# EasyEDA schematic Sheet_1.json
TITLE: 8 Bit ALU - 1 Bit; REV: 1.0; Date: 2021-12-28; Sheet: 1/3; Drawn By: Koehler, Paul; Company: komed3
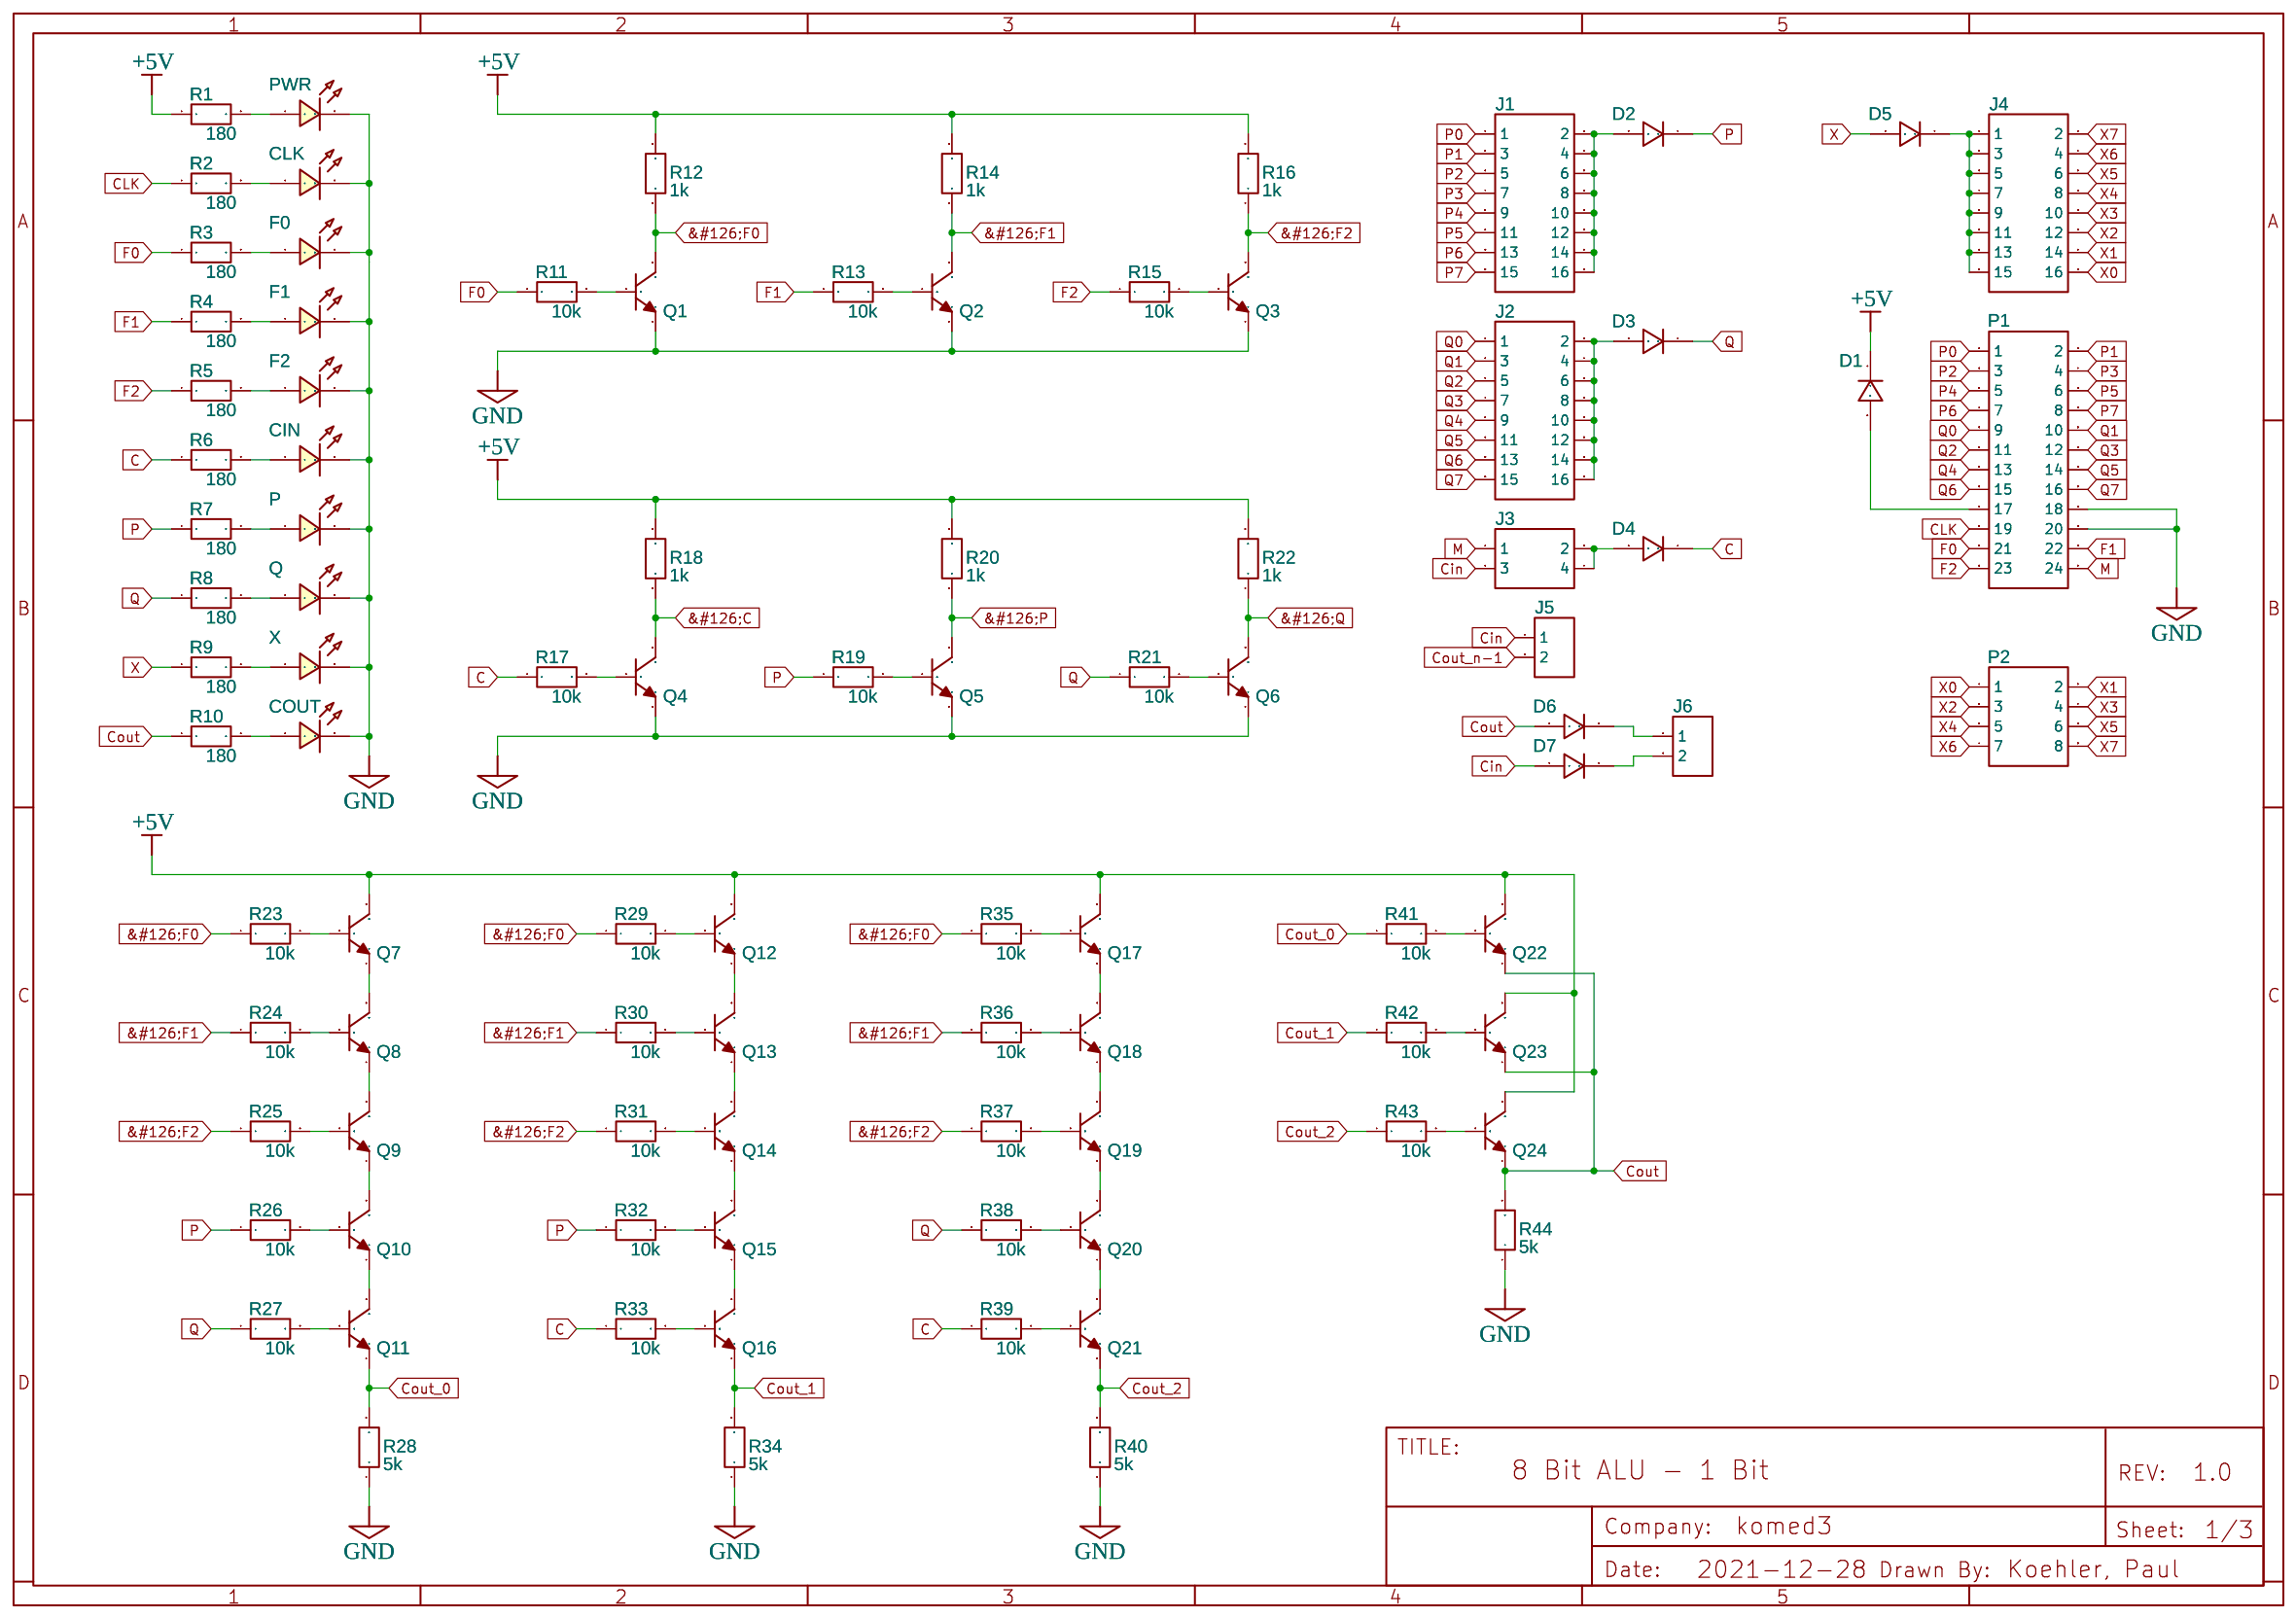
[diagram p0: schematic sheet]

## Parts
CIN  LED-TH-5mm_R  [LED-TH_BD5.0_RED]
CLK  LED-TH-5mm_R  [LED-TH_BD5.0_RED]
COUT  LED-TH-5mm_R  [LED-TH_BD5.0_RED]
D1  1N4007  [DO-41_BD2.4-L4.7-P8.70-D0.9-RD]
D2  1N4007  [DO-41_BD2.4-L4.7-P8.70-D0.9-RD]
D3  1N4007  [DO-41_BD2.4-L4.7-P8.70-D0.9-RD]
D4  1N4007  [DO-41_BD2.4-L4.7-P8.70-D0.9-RD]
D5  1N4007  [DO-41_BD2.4-L4.7-P8.70-D0.9-RD]
D6  1N4007  [DO-41_BD2.4-L4.7-P8.70-D0.9-RD]
D7  1N4007  [DO-41_BD2.4-L4.7-P8.70-D0.9-RD]
F0  LED-TH-5mm_R  [LED-TH_BD5.0_RED]
F1  LED-TH-5mm_R  [LED-TH_BD5.0_RED]
F2  LED-TH-5mm_R  [LED-TH_BD5.0_RED]
J1  HDR-M-2.54_2x8  [HDR-M-2.54_2X8]
J2  HDR-M-2.54_2x8  [HDR-M-2.54_2X8]
J3  HDR-M-2.54_2x2  [HDR-M-2.54_2X2]
J4  HDR-M-2.54_2x8  [HDR-M-2.54_2X8]
J5  HDR-M-2.54_1x2  [HDR-M-2.54_1X2]
J6  HDR-M-2.54_1x2  [HDR-M-2.54_1X2]
P  LED-TH-5mm_R  [LED-TH_BD5.0_RED]
P1  HDR-IDC-2.54-2X12P  [IDC-TH_24P-P2.54-V-R2-C12-S2.54]
P2  HDR-IDC-2.54-2X4P  [IDC-TH_8P-P2.54-V-R2-C4-S2.54]
PWR  LED-TH-5mm_R  [LED-TH_BD5.0_RED]
Q  LED-TH-5mm_R  [LED-TH_BD5.0_RED]
Q1  2N3904(TO-92)  [TO-92-3_L5.1-W4.1-P1.27-L]
Q2  2N3904(TO-92)  [TO-92-3_L5.1-W4.1-P1.27-L]
Q3  2N3904(TO-92)  [TO-92-3_L5.1-W4.1-P1.27-L]
Q4  2N3904(TO-92)  [TO-92-3_L5.1-W4.1-P1.27-L]
Q5  2N3904(TO-92)  [TO-92-3_L5.1-W4.1-P1.27-L]
Q6  2N3904(TO-92)  [TO-92-3_L5.1-W4.1-P1.27-L]
Q7  2N3904(TO-92)  [TO-92-3_L5.1-W4.1-P1.27-L]
Q8  2N3904(TO-92)  [TO-92-3_L5.1-W4.1-P1.27-L]
Q9  2N3904(TO-92)  [TO-92-3_L5.1-W4.1-P1.27-L]
Q10  2N3904(TO-92)  [TO-92-3_L5.1-W4.1-P1.27-L]
Q11  2N3904(TO-92)  [TO-92-3_L5.1-W4.1-P1.27-L]
Q12  2N3904(TO-92)  [TO-92-3_L5.1-W4.1-P1.27-L]
Q13  2N3904(TO-92)  [TO-92-3_L5.1-W4.1-P1.27-L]
Q14  2N3904(TO-92)  [TO-92-3_L5.1-W4.1-P1.27-L]
Q15  2N3904(TO-92)  [TO-92-3_L5.1-W4.1-P1.27-L]
Q16  2N3904(TO-92)  [TO-92-3_L5.1-W4.1-P1.27-L]
Q17  2N3904(TO-92)  [TO-92-3_L5.1-W4.1-P1.27-L]
Q18  2N3904(TO-92)  [TO-92-3_L5.1-W4.1-P1.27-L]
Q19  2N3904(TO-92)  [TO-92-3_L5.1-W4.1-P1.27-L]
Q20  2N3904(TO-92)  [TO-92-3_L5.1-W4.1-P1.27-L]
Q21  2N3904(TO-92)  [TO-92-3_L5.1-W4.1-P1.27-L]
Q22  2N3904(TO-92)  [TO-92-3_L5.1-W4.1-P1.27-L]
Q23  2N3904(TO-92)  [TO-92-3_L5.1-W4.1-P1.27-L]
Q24  2N3904(TO-92)  [TO-92-3_L5.1-W4.1-P1.27-L]
R1  180  [RESISTOR-1/2W-VERTICAL]
R2  180  [RESISTOR-1/2W-VERTICAL]
R3  180  [RESISTOR-1/2W-VERTICAL]
R4  180  [RESISTOR-1/2W-VERTICAL]
R5  180  [RESISTOR-1/2W-VERTICAL]
R6  180  [RESISTOR-1/2W-VERTICAL]
R7  180  [RESISTOR-1/2W-VERTICAL]
R8  180  [RESISTOR-1/2W-VERTICAL]
R9  180  [RESISTOR-1/2W-VERTICAL]
R10  180  [RESISTOR-1/2W-VERTICAL]
R11  10k  [RESISTOR-1/2W-VERTICAL]
R12  1k  [RESISTOR-1/2W-VERTICAL]
R13  10k  [RESISTOR-1/2W-VERTICAL]
R14  1k  [RESISTOR-1/2W-VERTICAL]
R15  10k  [RESISTOR-1/2W-VERTICAL]
R16  1k  [RESISTOR-1/2W-VERTICAL]
R17  10k  [RESISTOR-1/2W-VERTICAL]
R18  1k  [RESISTOR-1/2W-VERTICAL]
R19  10k  [RESISTOR-1/2W-VERTICAL]
R20  1k  [RESISTOR-1/2W-VERTICAL]
R21  10k  [RESISTOR-1/2W-VERTICAL]
R22  1k  [RESISTOR-1/2W-VERTICAL]
R23  10k  [RESISTOR-1/2W-VERTICAL]
R24  10k  [RESISTOR-1/2W-VERTICAL]
R25  10k  [RESISTOR-1/2W-VERTICAL]
R26  10k  [RESISTOR-1/2W-VERTICAL]
R27  10k  [RESISTOR-1/2W-VERTICAL]
R28  5k  [RESISTOR-1/2W-VERTICAL]
R29  10k  [RESISTOR-1/2W-VERTICAL]
R30  10k  [RESISTOR-1/2W-VERTICAL]
R31  10k  [RESISTOR-1/2W-VERTICAL]
R32  10k  [RESISTOR-1/2W-VERTICAL]
R33  10k  [RESISTOR-1/2W-VERTICAL]
R34  5k  [RESISTOR-1/2W-VERTICAL]
R35  10k  [RESISTOR-1/2W-VERTICAL]
R36  10k  [RESISTOR-1/2W-VERTICAL]
R37  10k  [RESISTOR-1/2W-VERTICAL]
R38  10k  [RESISTOR-1/2W-VERTICAL]
R39  10k  [RESISTOR-1/2W-VERTICAL]
R40  5k  [RESISTOR-1/2W-VERTICAL]
R41  10k  [RESISTOR-1/2W-VERTICAL]
R42  10k  [RESISTOR-1/2W-VERTICAL]
R43  10k  [RESISTOR-1/2W-VERTICAL]
R44  5k  [RESISTOR-1/2W-VERTICAL]
X  LED-TH-5mm_R  [LED-TH_BD5.0_RED]

## Library data of the parts
CIN CLK COUT F0-F2 P PWR Q X = LED-TH-5mm_R: Manufacturer: EVERLIGHT(台湾亿光); Manufacturer Part: 333-2SURD/S530-A3; Supplier Part: C87271; Supplier: LCSC; Contributor: LCEDA_Lib
D1-D7 = 1N4007: Supplier: LCSC; Manufacturer: SEMTECH; Supplier Part: C106903; Contributor: LCEDA_Lib
J1 J2 J4 = HDR-M-2.54_2x8: Supplier Part: C68234; Supplier: LCSC; Contributor: LCEDA_Lib
J3 = HDR-M-2.54_2x2: Supplier Part: C66690; Supplier: LCSC; Contributor: LCEDA_Lib
J5 J6 = HDR-M-2.54_1x2: Supplier Part: C124375; Supplier: LCSC; Contributor: LCEDA_Lib
P1 = HDR-IDC-2.54-2X12P: Supplier: LCSC; Manufacturer: BOOMELE; Manufacturer Part: IDC Box 2X12 2.54MM; image: //image.lceda.cn/szlcsc/C9137.jpg; Supplier Part: C9137
P2 = HDR-IDC-2.54-2X4P: Supplier: LCSC; Manufacturer: BOOMELE; Manufacturer Part: IDC Box 2X4 2.54MM; image: //image.lceda.cn/szlcsc/C9135.jpg; Supplier Part: C9135
Q1-Q24 = 2N3904(TO-92): Supplier: LCSC; Manufacturer: SEMTECH; Manufacturer Part: 2N3904; Supplier Part: C118538; Contributor: LCEDA_Lib
R1-R44 = R_AXIAL-0.3_EU: Contributor: LCEDA_Lib

## Nets
+5V: D1.1 Q7.3(C) Q12.3(C) Q17.3(C) Q22.3(C) Q23.3(C) Q24.3(C) R1.1 R12.2 R14.2 R16.2 R18.2 R20.2 R22.2
GND: CIN.2 CLK.2 COUT.2 F0.2 F1.2 F2.2 P.2 P1.18 P1.20 PWR.2 Q.2 Q1.1(E) Q2.1(E) Q3.1(E) Q4.1(E) Q5.1(E) Q6.1(E) R28.1 R34.1 R40.1 R44.1 X.2
&#126;C: Q4.3(C) R18.1
&#126;F0: Q1.3(C) R12.1 R23.1 R29.1 R35.1
&#126;F1: Q2.3(C) R14.1 R24.1 R30.1 R36.1
&#126;F2: Q3.3(C) R16.1 R25.1 R31.1 R37.1
&#126;P: Q5.3(C) R20.1
&#126;Q: Q6.3(C) R22.1
C: D4.1 R6.1 R17.1 R33.1 R39.1
Cin: D7.2 J3.3 J5.1
CLK: P1.19 R2.1
Cout: D6.2 Q22.1(E) Q23.1(E) Q24.1(E) R10.1 R44.2
Cout_0: Q11.1(E) R28.2 R41.1
Cout_1: Q16.1(E) R34.2 R42.1
Cout_2: Q21.1(E) R40.2 R43.1
Cout_n-1: J5.2
F0: P1.21 R3.1 R11.1
F1: P1.22 R4.1 R13.1
F2: P1.23 R5.1 R15.1
M: J3.1 P1.24
P: D2.1 R7.1 R19.1 R26.1 R32.1
P0: J1.1 P1.1
P1: J1.3 P1.2
P2: J1.5 P1.3
P3: J1.7 P1.4
P4: J1.9 P1.5
P5: J1.11 P1.6
P6: J1.13 P1.7
P7: J1.15 P1.8
Q: D3.1 R8.1 R21.1 R27.1 R38.1
Q0: J2.1 P1.9
Q1: J2.3 P1.10
Q2: J2.5 P1.11
Q3: J2.7 P1.12
Q4: J2.9 P1.13
Q5: J2.11 P1.14
Q6: J2.13 P1.15
Q7: J2.15 P1.16
X: D5.2 R9.1
X0: J4.16 P2.1
X1: J4.14 P2.2
X2: J4.12 P2.3
X3: J4.10 P2.4
X4: J4.8 P2.5
X5: J4.6 P2.6
X6: J4.4 P2.7
X7: J4.2 P2.8
Net-(CIN-1): CIN.1 R6.2
Net-(CLK-1): CLK.1 R2.2
Net-(COUT-1): COUT.1 R10.2
Net-(D1-2): D1.2 P1.17
Net-(D2-2): D2.2 J1.2 J1.4 J1.6 J1.8 J1.10 J1.12 J1.14 J1.16
Net-(D3-2): D3.2 J2.2 J2.4 J2.6 J2.8 J2.10 J2.12 J2.14 J2.16
Net-(D4-2): D4.2 J3.2 J3.4
Net-(D5-1): D5.1 J4.1 J4.3 J4.5 J4.7 J4.9 J4.11 J4.13 J4.15
Net-(D6-1): D6.1 J6.1
Net-(D7-1): D7.1 J6.2
Net-(F0-1): F0.1 R3.2
Net-(F1-1): F1.1 R4.2
Net-(F2-1): F2.1 R5.2
Net-(P-1): P.1 R7.2
Net-(PWR-1): PWR.1 R1.2
Net-(Q1-2): Q1.2(B) R11.2
Net-(Q2-2): Q2.2(B) R13.2
Net-(Q3-2): Q3.2(B) R15.2
Net-(Q4-2): Q4.2(B) R17.2
Net-(Q5-2): Q5.2(B) R19.2
Net-(Q6-2): Q6.2(B) R21.2
Net-(Q7-1): Q7.1(E) Q8.3(C)
Net-(Q7-2): Q7.2(B) R23.2
Net-(Q8-1): Q8.1(E) Q9.3(C)
Net-(Q8-2): Q8.2(B) R24.2
Net-(Q9-1): Q9.1(E) Q10.3(C)
Net-(Q9-2): Q9.2(B) R25.2
Net-(Q10-1): Q10.1(E) Q11.3(C)
Net-(Q10-2): Q10.2(B) R26.2
Net-(Q11-2): Q11.2(B) R27.2
Net-(Q12-1): Q12.1(E) Q13.3(C)
Net-(Q12-2): Q12.2(B) R29.2
Net-(Q13-1): Q13.1(E) Q14.3(C)
Net-(Q13-2): Q13.2(B) R30.2
Net-(Q14-1): Q14.1(E) Q15.3(C)
Net-(Q14-2): Q14.2(B) R31.2
Net-(Q15-1): Q15.1(E) Q16.3(C)
Net-(Q15-2): Q15.2(B) R32.2
Net-(Q16-2): Q16.2(B) R33.2
Net-(Q17-1): Q17.1(E) Q18.3(C)
Net-(Q17-2): Q17.2(B) R35.2
Net-(Q18-1): Q18.1(E) Q19.3(C)
Net-(Q18-2): Q18.2(B) R36.2
Net-(Q19-1): Q19.1(E) Q20.3(C)
Net-(Q19-2): Q19.2(B) R37.2
Net-(Q20-1): Q20.1(E) Q21.3(C)
Net-(Q20-2): Q20.2(B) R38.2
Net-(Q21-2): Q21.2(B) R39.2
Net-(Q22-2): Q22.2(B) R41.2
Net-(Q23-2): Q23.2(B) R42.2
Net-(Q24-2): Q24.2(B) R43.2
Net-(Q-1): Q.1 R8.2
Net-(R9-2): R9.2 X.1
